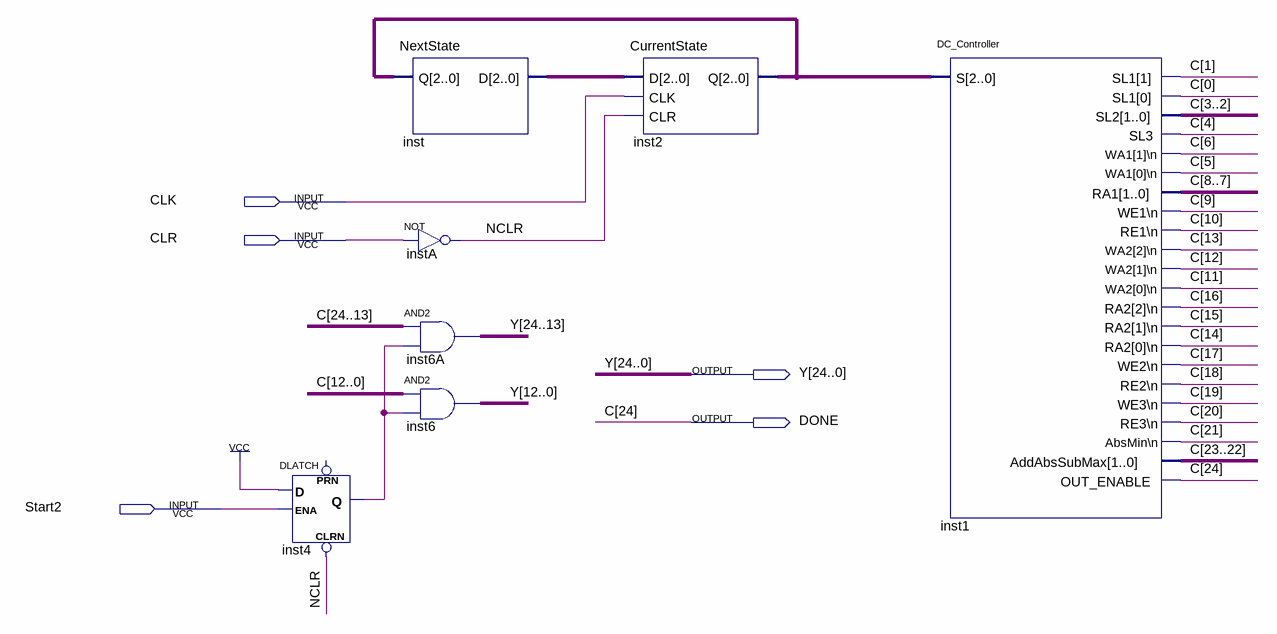
[diagram p0: schematic sheet]
// Quartus schematic DC_FINAL_CONTROLLER.bdf as structural Verilog: 7 symbols, 5 pins
module DC_FINAL_CONTROLLER (
  input  CLK,
  input  CLR,
  input  Start2,
  output [24:0] Y,
  output DONE
);

  wire inst4_q, NCLR;
  wire [2:0] inst2_q, inst_d;
  wire [23:0] C;

  DLATCH inst4 (.CLRN(NCLR), .D(1'b1), .ENA(Start2), .Q(inst4_q));  // open: PRN
  NextState inst (.Q(inst2_q), .D(inst_d));
  not instA (NCLR, CLR);
  assign Y[24:13] = {DONE, C[23:13]} & {12{inst4_q}};  // AND2 inst6A, 12 bits wide
  assign Y[12:0] = C[12:0] & {13{inst4_q}};  // AND2 inst6, 13 bits wide
  CurrentState inst2 (.D(inst_d), .CLK(CLK), .CLR(NCLR), .Q(inst2_q));
  DC_Controller inst1 (
    .S(inst2_q), .SL1(C[1:0]), .SL2(C[3:2]), .SL3(C[4]), .\WA1[1]\n (C[6]), .\WA1[0]\n (C[5]), .RA1(C[8:7]),
    .\WE1\n (C[9]), .\RE1\n (C[10]), .\WA2[2]\n (C[13]), .\WA2[1]\n (C[12]), .\WA2[0]\n (C[11]),
    .\RA2[2]\n (C[16]), .\RA2[1]\n (C[15]), .\RA2[0]\n (C[14]), .\WE2\n (C[17]), .\RE2\n (C[18]),
    .\WE3\n (C[19]), .\RE3\n (C[20]), .\AbsMin\n (C[21]), .AddAbsSubMax(C[23:22]), .OUT_ENABLE(DONE));

  // Other names for the same wires on the sheet: C[24] = DONE
endmodule
